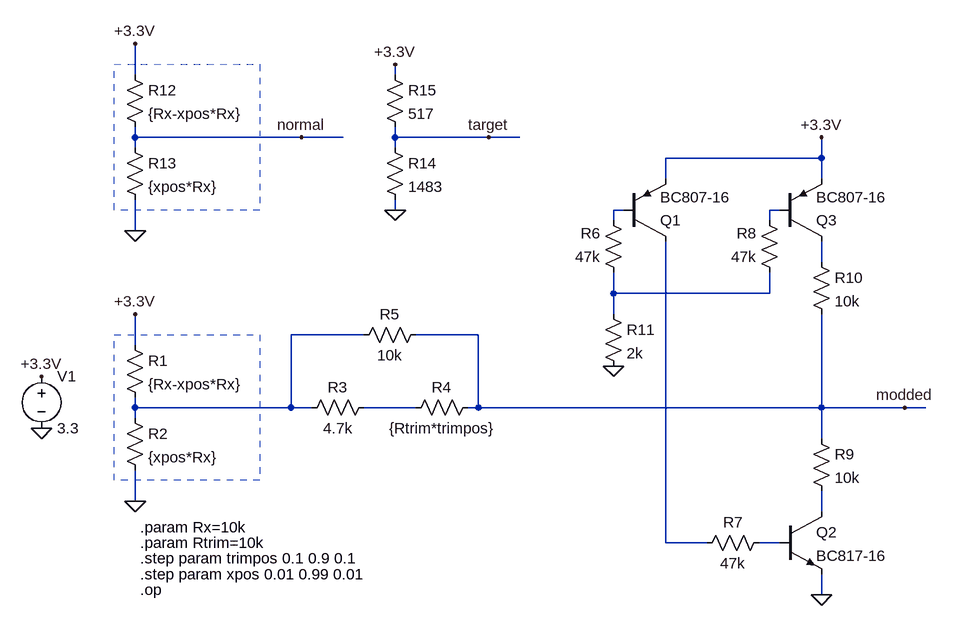
[diagram p0: schematic WalkMod.asc]
WalkMod.asc, the LTspice schematic file:
Version 4
SHEET 1 1328 680
WIRE 80 -352 80 -400
WIRE 480 -352 480 -368
WIRE 80 -256 80 -272
WIRE 336 -256 80 -256
WIRE 400 -256 336 -256
WIRE 480 -256 480 -272
WIRE 624 -256 480 -256
WIRE 672 -256 624 -256
WIRE 80 -240 80 -256
WIRE 480 -240 480 -256
WIRE 1136 -224 1136 -256
WIRE 1136 -224 896 -224
WIRE 896 -192 896 -224
WIRE 1136 -192 1136 -224
WIRE 480 -144 480 -160
WIRE 832 -144 816 -144
WIRE 1072 -144 1056 -144
WIRE 816 -128 816 -144
WIRE 1056 -128 1056 -144
WIRE 80 -112 80 -160
WIRE 1136 -64 1136 -96
WIRE 816 -16 816 -48
WIRE 1056 -16 1056 -48
WIRE 1056 -16 816 -16
WIRE 816 16 816 -16
WIRE 432 48 320 48
WIRE 608 48 512 48
WIRE 80 64 80 16
WIRE 80 160 80 144
WIRE 320 160 320 48
WIRE 320 160 80 160
WIRE 352 160 320 160
WIRE 512 160 432 160
WIRE 608 160 608 48
WIRE 608 160 592 160
WIRE 1136 160 1136 16
WIRE 1136 160 608 160
WIRE 1264 160 1136 160
WIRE 1296 160 1264 160
WIRE 80 176 80 160
WIRE 1136 208 1136 160
WIRE 80 304 80 256
WIRE 1136 320 1136 288
WIRE 896 368 896 -96
WIRE 960 368 896 368
WIRE 1072 368 1040 368
WIRE 1136 448 1136 416
FLAG 80 304 0
FLAG 80 16 +3.3V
FLAG -64 192 0
FLAG -64 112 +3.3V
FLAG 1136 448 0
FLAG 1136 -256 +3.3V
FLAG 1264 160 modded
FLAG 816 96 0
FLAG 80 -112 0
FLAG 80 -400 +3.3V
FLAG 336 -256 normal
FLAG 480 -144 0
FLAG 480 -368 +3.3V
FLAG 624 -256 target
SYMBOL res 64 48 R0
SYMATTR InstName R1
SYMATTR Value {Rx-xpos*Rx}
SYMBOL res 64 160 R0
SYMATTR InstName R2
SYMATTR Value {xpos*Rx}
SYMBOL voltage -64 96 R0
WINDOW 123 0 0 Left 0
WINDOW 39 0 0 Left 0
SYMATTR InstName V1
SYMATTR Value 3.3
SYMBOL res 448 144 R90
WINDOW 0 0 56 VBottom 2
WINDOW 3 32 56 VTop 2
SYMATTR InstName R3
SYMATTR Value 4.7k
SYMBOL res 608 144 R90
WINDOW 0 0 56 VBottom 2
WINDOW 3 32 56 VTop 2
SYMATTR InstName R4
SYMATTR Value {Rtrim*trimpos}
SYMBOL res 528 32 R90
WINDOW 0 0 56 VBottom 2
WINDOW 3 32 56 VTop 2
SYMATTR InstName R5
SYMATTR Value 10k
SYMBOL pnp 832 -96 M180
SYMATTR InstName Q1
SYMATTR Value BC807-16
SYMBOL npn 1072 320 R0
SYMATTR InstName Q2
SYMATTR Value BC817-16
SYMBOL res 832 -32 R180
WINDOW 0 36 76 Left 2
WINDOW 3 36 40 Left 2
SYMATTR InstName R6
SYMATTR Value 47k
SYMBOL res 944 384 R270
WINDOW 0 32 56 VTop 2
WINDOW 3 0 56 VBottom 2
SYMATTR InstName R7
SYMATTR Value 47k
SYMBOL pnp 1072 -96 M180
SYMATTR InstName Q3
SYMATTR Value BC807-16
SYMBOL res 1072 -32 R180
WINDOW 0 36 76 Left 2
WINDOW 3 36 40 Left 2
SYMATTR InstName R8
SYMATTR Value 47k
SYMBOL res 1120 192 R0
SYMATTR InstName R9
SYMATTR Value 10k
SYMBOL res 1120 -80 R0
SYMATTR InstName R10
SYMATTR Value 10k
SYMBOL res 800 0 R0
SYMATTR InstName R11
SYMATTR Value 2k
SYMBOL res 64 -368 R0
SYMATTR InstName R12
SYMATTR Value {Rx-xpos*Rx}
SYMBOL res 64 -256 R0
SYMATTR InstName R13
SYMATTR Value {xpos*Rx}
SYMBOL res 464 -256 R0
SYMATTR InstName R14
SYMATTR Value 1483
SYMBOL res 464 -368 R0
SYMATTR InstName R15
SYMATTR Value 517
TEXT 88 344 Left 2 !.param Rx=10k
TEXT 88 416 Left 2 !.step param xpos 0.01 0.99 0.01
TEXT 88 440 Left 2 !.op
TEXT 88 368 Left 2 !.param Rtrim=10k
TEXT 88 392 Left 2 !.step param trimpos 0.1 0.9 0.1
LINE Normal 48 272 48 48 2
LINE Normal 272 272 48 272 2
LINE Normal 272 48 272 272 2
LINE Normal 48 48 272 48 2
LINE Normal 48 -144 48 -368 2
LINE Normal 272 -144 48 -144 2
LINE Normal 272 -368 272 -144 2
LINE Normal 48 -368 272 -368 2

The netlist it stands for:
* WalkMod.asc
R1 +3.3V N005 {Rx-xpos*Rx}
R2 N005 0 {xpos*Rx}
V1 +3.3V 0 3.3
R3 N006 N005 4.7k
R4 modded N006 {Rtrim*trimpos}
R5 modded N005 10k
Q1 N008 N001 +3.3V 0 BC807-16
Q2 N007 N009 0 0 BC817-16
R6 N004 N001 47k
R7 N008 N009 47k
Q3 N003 N002 +3.3V 0 BC807-16
R8 N004 N002 47k
R9 modded N007 10k
R10 N003 modded 10k
R11 N004 0 2k
R12 +3.3V normal {Rx-xpos*Rx}
R13 normal 0 {xpos*Rx}
R14 target 0 1483
R15 +3.3V target 517
.model NPN NPN
.model PNP PNP
.lib standard.bjt
.param Rx=10k
.step param xpos 0.01 0.99 0.01
.op
.param Rtrim=10k
.step param trimpos 0.1 0.9 0.1
.backanno
.end